# EAGLE design control_pad_v1-1-0x (EAGLE 9.6.2)
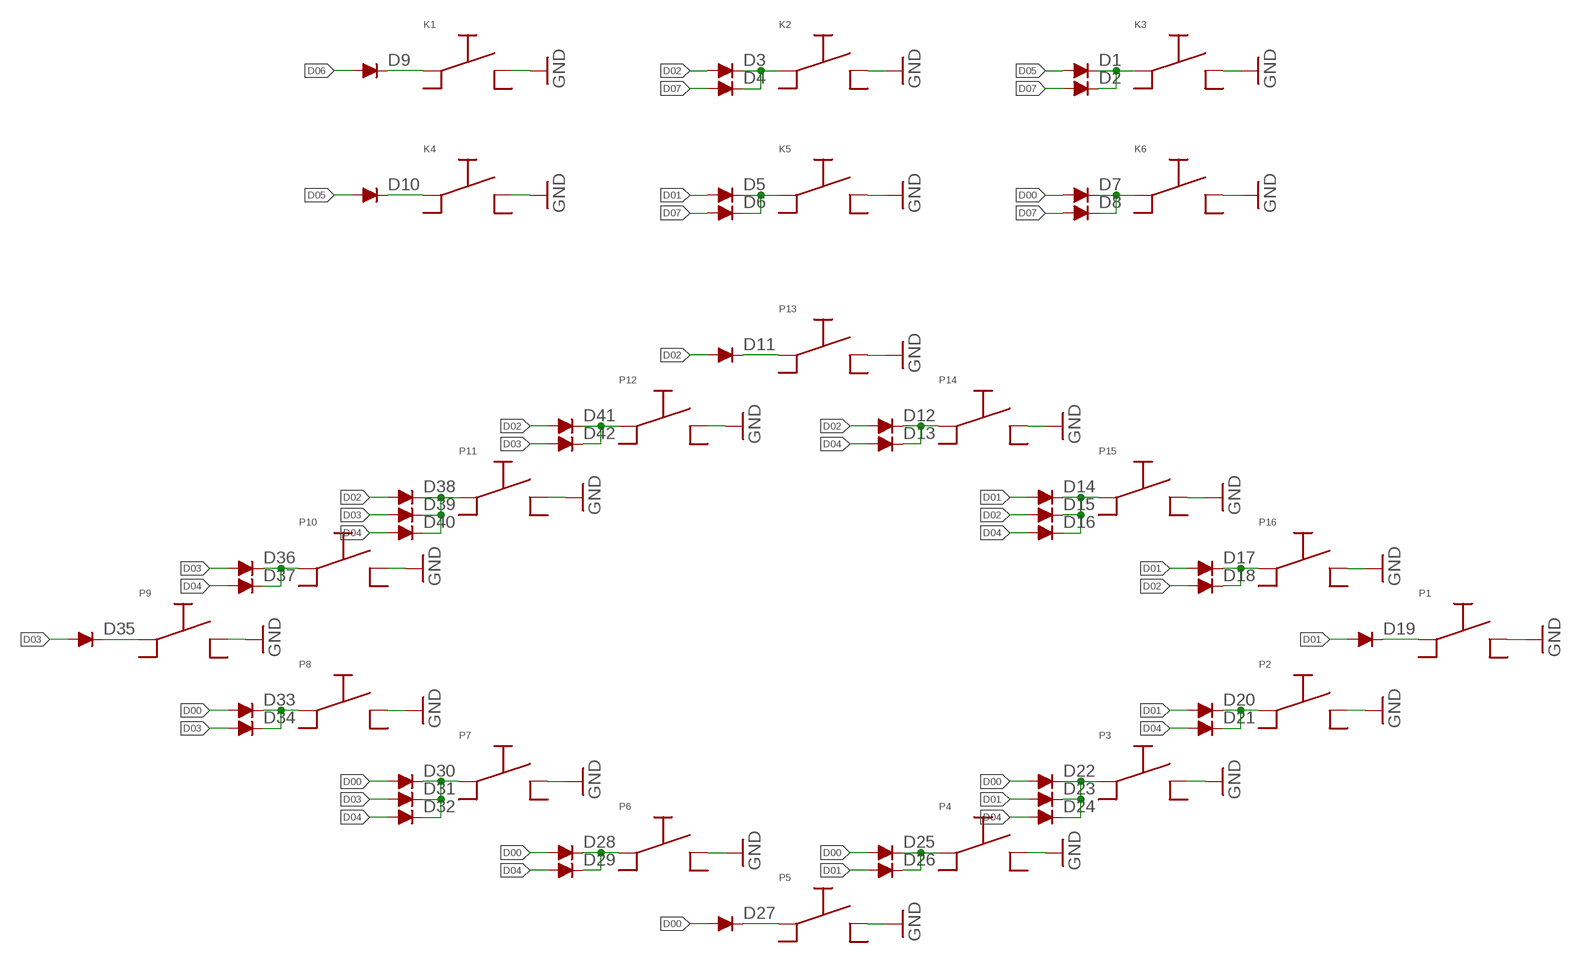
[diagram p0: schematic, sheet 1]

## Parts
D1  1N4148  [DO35-10]
D2  1N4148  [DO35-10]
D3  1N4148  [DO35-10]
D4  1N4148  [DO35-10]
D5  1N4148  [DO35-10]
D6  1N4148  [DO35-10]
D7  1N4148  [DO35-10]
D8  1N4148  [DO35-10]
D9  1N4148  [DO35-10]
D10  1N4148  [DO35-10]
D11  1N4148  [DO35-10]
D12  1N4148  [DO35-10]
D13  1N4148  [DO35-10]
D14  1N4148  [DO35-10]
D15  1N4148  [DO35-10]
D16  1N4148  [DO35-10]
D17  1N4148  [DO35-10]
D18  1N4148  [DO35-10]
D19  1N4148  [DO35-10]
D20  1N4148  [DO35-10]
D21  1N4148  [DO35-10]
D22  1N4148  [DO35-10]
D23  1N4148  [DO35-10]
D24  1N4148  [DO35-10]
D25  1N4148  [DO35-10]
D26  1N4148  [DO35-10]
D27  1N4148  [DO35-10]
D28  1N4148  [DO35-10]
D29  1N4148  [DO35-10]
D30  1N4148  [DO35-10]
D31  1N4148  [DO35-10]
D32  1N4148  [DO35-10]
D33  1N4148  [DO35-10]
D34  1N4148  [DO35-10]
D35  1N4148  [DO35-10]
D36  1N4148  [DO35-10]
D37  1N4148  [DO35-10]
D38  1N4148  [DO35-10]
D39  1N4148  [DO35-10]
D40  1N4148  [DO35-10]
D41  1N4148  [DO35-10]
D42  1N4148  [DO35-10]
K1  TACT-SPST  [TACT-SPST]
K2  TACT-SPST  [TACT-SPST]
K3  TACT-SPST  [TACT-SPST]
K4  TACT-SPST  [TACT-SPST]
K5  TACT-SPST  [TACT-SPST]
K6  TACT-SPST  [TACT-SPST]
P1  TACT-SPST  [TACT-SPST]
P2  TACT-SPST  [TACT-SPST]
P3  TACT-SPST  [TACT-SPST]
P4  TACT-SPST  [TACT-SPST]
P5  TACT-SPST  [TACT-SPST]
P6  TACT-SPST  [TACT-SPST]
P7  TACT-SPST  [TACT-SPST]
P8  TACT-SPST  [TACT-SPST]
P9  TACT-SPST  [TACT-SPST]
P10  TACT-SPST  [TACT-SPST]
P11  TACT-SPST  [TACT-SPST]
P12  TACT-SPST  [TACT-SPST]
P13  TACT-SPST  [TACT-SPST]
P14  TACT-SPST  [TACT-SPST]
P15  TACT-SPST  [TACT-SPST]
P16  TACT-SPST  [TACT-SPST]

## Nets
D00: D7.A D22.A D25.A D27.A D28.A D30.A D33.A
D01: D5.A D14.A D17.A D19.A D20.A D23.A D26.A
D02: D3.A D11.A D12.A D15.A D18.A D38.A D41.A
D03: D31.A D34.A D35.A D36.A D39.A D42.A
D04: D13.A D16.A D21.A D24.A D29.A D32.A D37.A D40.A
D05: D1.A D10.A
D06: D9.A
D07: D2.A D4.A D6.A D8.A
GND: K1.P$2 K1.P$4 K2.P$2 K2.P$4 K3.P$2 K3.P$4 K4.P$2 K4.P$4 K5.P$2 K5.P$4 K6.P$2 K6.P$4 P1.P$2 P1.P$4 P2.P$2 P2.P$4 P3.P$2 P3.P$4 P4.P$2 P4.P$4 P5.P$2 P5.P$4 P6.P$2 P6.P$4 P7.P$2 P7.P$4 P8.P$2 P8.P$4 P9.P$2 P9.P$4 P10.P$2 P10.P$4 P11.P$2 P11.P$4 P12.P$2 P12.P$4 P13.P$2 P13.P$4 P14.P$2 P14.P$4 P15.P$2 P15.P$4 P16.P$2 P16.P$4
N$1: D9.C K1.P$1 K1.P$3
N$2: D10.C K4.P$1 K4.P$3
N$3: D11.C P13.P$1 P13.P$3
N$6: D1.C D2.C K3.P$1 K3.P$3
N$9: D3.C D4.C K2.P$1 K2.P$3
N$11: D5.C D6.C K5.P$1 K5.P$3
N$13: D7.C D8.C K6.P$1 K6.P$3
N$14: D14.C D15.C D16.C P15.P$1 P15.P$3
N$16: D12.C D13.C P14.P$1 P14.P$3
N$17: D19.C P1.P$1 P1.P$3
N$20: D17.C D18.C P16.P$1 P16.P$3
N$22: D20.C D21.C P2.P$1 P2.P$3
N$27: D22.C D23.C D24.C P3.P$1 P3.P$3
N$31: D25.C D26.C P4.P$1 P4.P$3
N$32: D27.C P5.P$1 P5.P$3
N$36: D28.C D29.C P6.P$1 P6.P$3
N$39: D30.C D31.C D32.C P7.P$1 P7.P$3
N$46: D33.C D34.C P8.P$1 P8.P$3
N$49: D35.C P9.P$1 P9.P$3
N$52: D36.C D37.C P10.P$1 P10.P$3
N$55: D38.C D39.C D40.C P11.P$1 P11.P$3
N$62: D41.C D42.C P12.P$1 P12.P$3

## Library data of the parts
D1-D42 = aq-diode:1N4148: DIODE high speed (Philips)
K1-K6 P1-P16 = aq-switch-misc:TACT-SPST: Tactile Switch - 6mm x 6mm generic

## Net classes
0 default: width 0.508 mm, clearance 0.127 mm

## Board
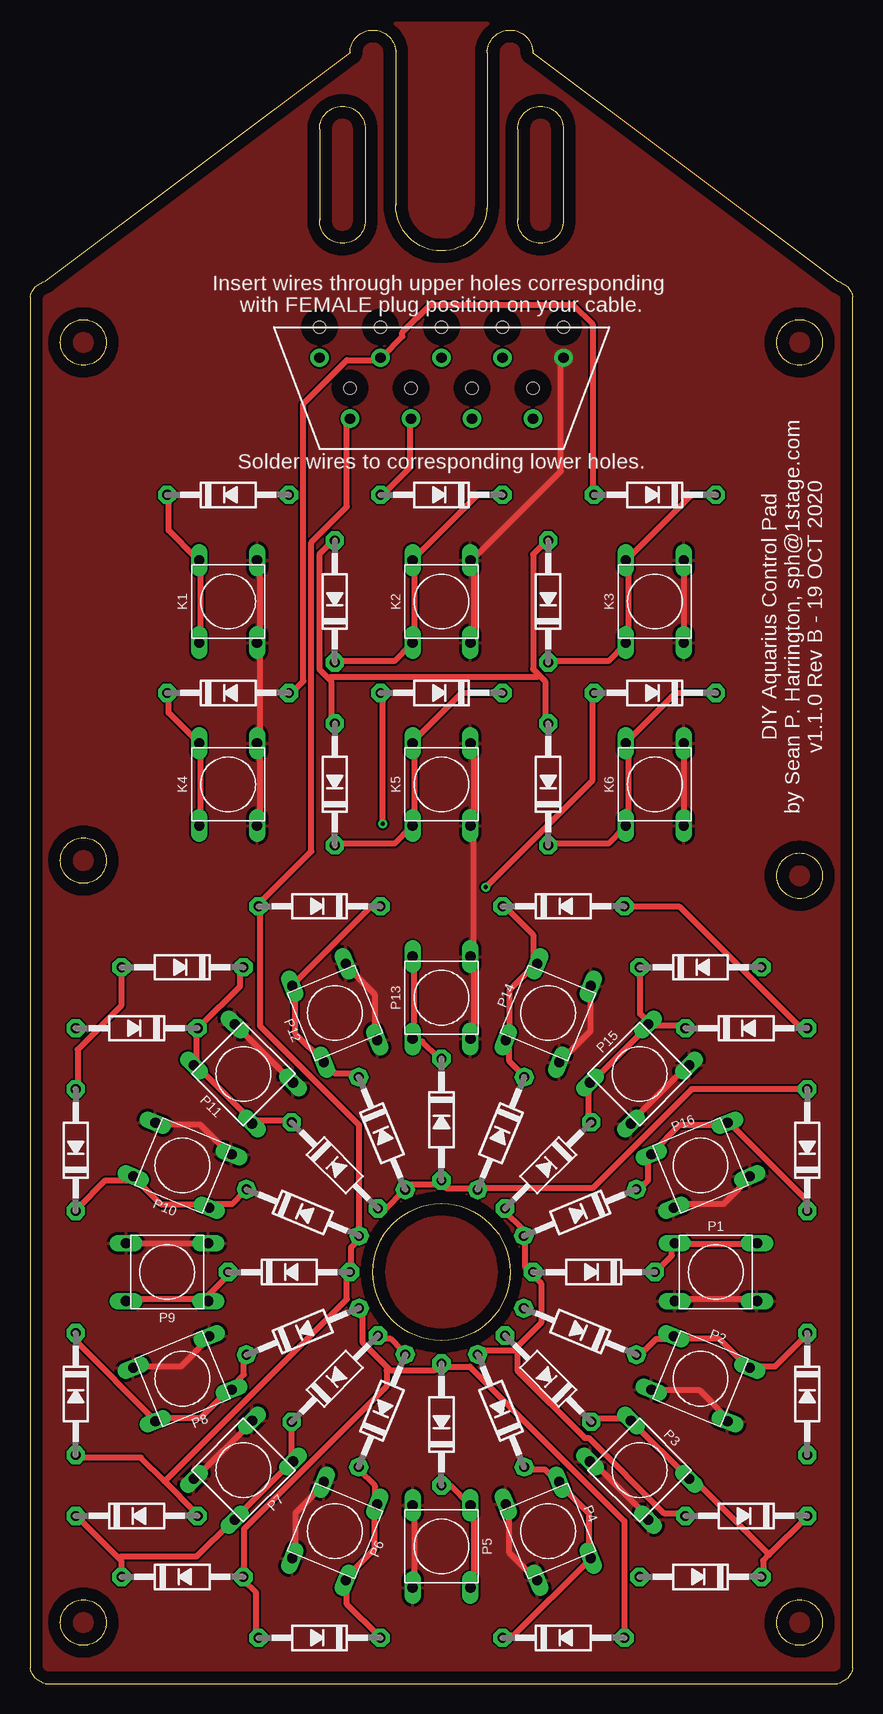
[diagram p1: board, top side]
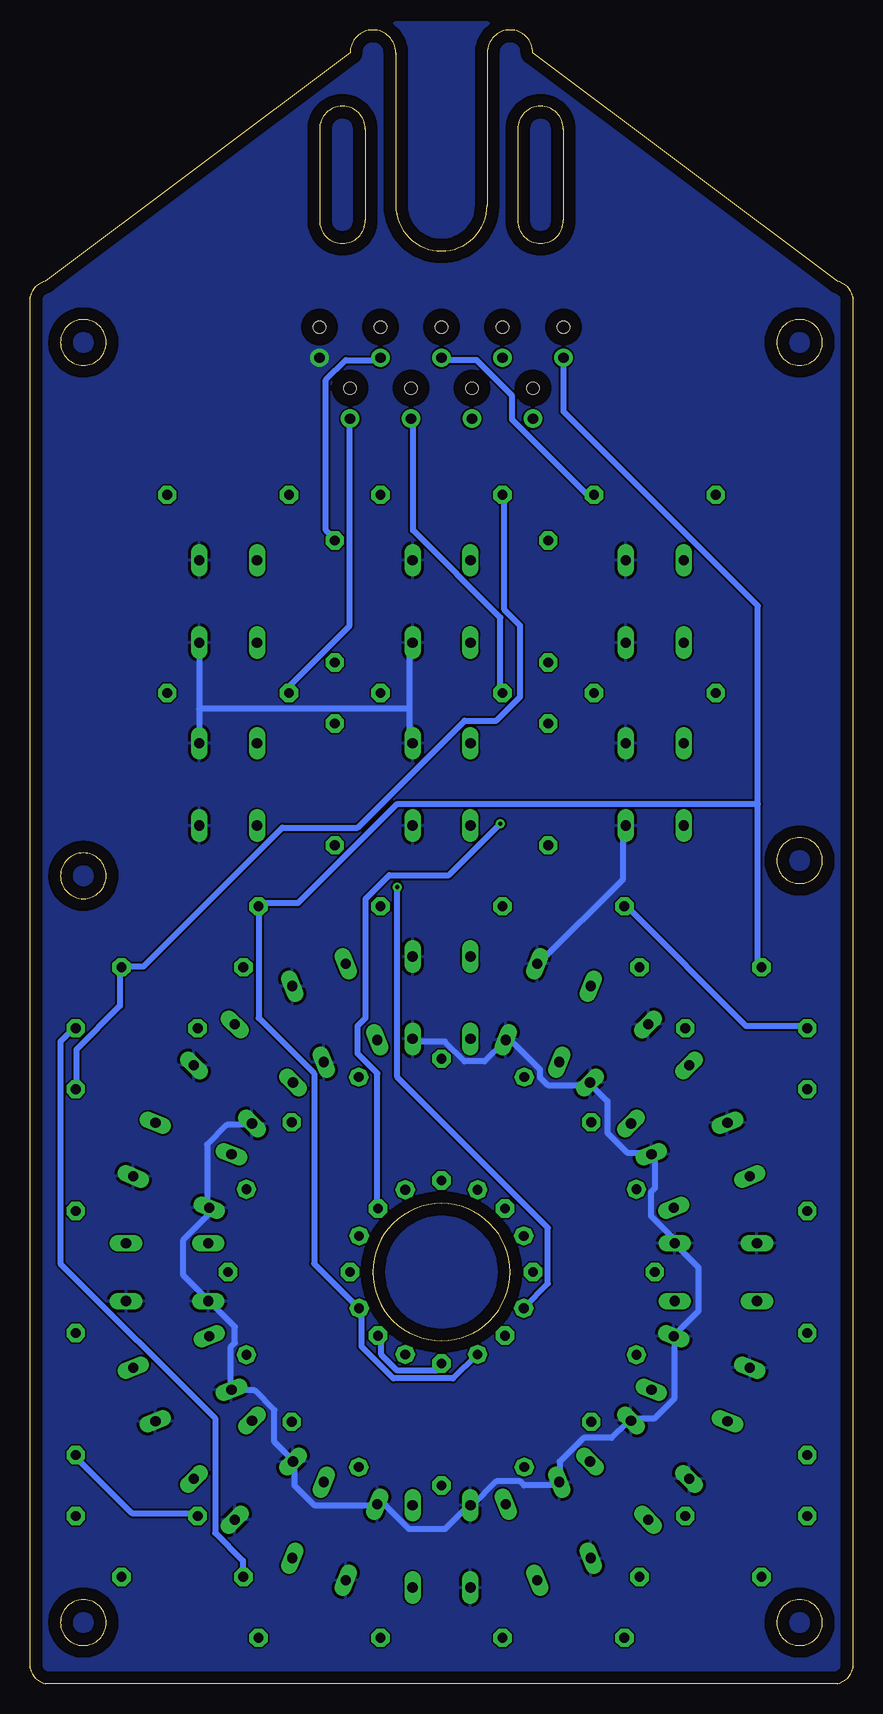
[diagram p2: board, bottom side, seen from below]

Size 68.58 x 137.79 mm. Coordinates in mm from the lower left corner, seen from the top.
Outline: 1.27,0 67.31,0 arc63 68.58,1.27 68.58,115.57 arc63 67.31,116.84 41.91,135.89 arc180 38.1,135.89 38.1,130.81 38.1,123.19 arc-180 30.48,123.19 30.48,130.81 30.48,135.89 arc180 26.67,135.89 1.27,116.84 arc63 0,115.57 0,1.27 arc63 1.27,0
Outline: 28.57,34.29 arc-180 40.01,34.29 arc-180 28.57,34.29
Outline: 44.45,129.54 44.45,121.92 arc-180 40.64,121.92 40.64,129.54 arc-180 44.45,129.54
Outline: 24.13,129.54 24.13,121.92 arc180 27.94,121.92 27.94,129.54 arc180 24.13,129.54
Outline: 62.23,111.76 arc-180 66.04,111.76 arc-180 62.23,111.76
Outline: 2.54,111.76 arc-180 6.35,111.76 arc-180 2.54,111.76
Outline: 6.35,5.08 arc-180 2.54,5.08 arc-180 6.35,5.08
Outline: 66.04,5.08 arc-180 62.23,5.08 arc-180 66.04,5.08
Outline: 66.04,67.31 arc-180 62.23,67.31 arc-180 66.04,67.31
Outline: 2.54,68.58 arc-180 6.35,68.58 arc-180 2.54,68.58
Copper layers (1*16): Top 0.035mm / dielectric 1.5mm / Bottom 0.035mm
Design rules "default": minimum track width 6mil, minimum drill 0.35mm, track to track 6mil, track to pad 6mil, pad to pad 6mil, via to via 6mil, smd to smd 6mil, copper to edge 40mil, drill to drill 6mil, minimum pad ring 10mil, minimum via ring 8mil, stop-mask expansion 4mil, vias tented up to drill 0mil, thermal gap 10mil
Holes 1 mm at 26.67,107.95 31.75,107.95 44.45,113.03 36.83,107.95 41.91,107.95 24.13,113.03 29.21,113.03 39.37,113.03 34.29,113.03

### Footprints (pad centres in the part's own frame; a part is rotated, then mirrored left to right if it is on the bottom)
DO35-10 = drill 0.813 pad 1.524 octagon: A 5.08,0; C -5.08,0
TACT-SPST = drill 0.85 long: P$1 -3.429,2.413; P$2 -3.429,-2.413; P$3 3.429,2.413; P$4 3.429,-2.413

### Placement (x,y rotation side)
D1  52.07,99.06 180 top
D2  43.18,90.17 90 top
D3  34.29,99.06 180 top
D4  25.4,90.17 90 top
D5  34.29,82.55 180 top
D6  25.4,74.93 90 top
D7  52.07,82.55 180 top
D8  43.18,74.93 90 top
D9  16.51,99.06 0 top
D10  16.51,82.55 0 top
D11  34.29,46.99 270 top
D12  39.24,45.85 247.5 top
D13  44.45,64.77 0 top
D14  43.18,43.18 225 top
D15  55.88,59.69 0 top
D16  59.69,54.61 0 top
D17  45.85,39.24 202.5 top
D18  64.77,44.45 90 top
D19  46.99,34.29 180 top
D20  64.77,24.13 270 top
D21  45.85,29.34 157.5 top
D22  43.18,25.4 135 top
D23  59.69,13.97 180 top
D24  55.88,8.89 180 top
D25  44.45,3.81 0 top
D26  39.24,22.73 112.5 top
D27  34.29,21.59 90 top
D28  24.13,3.81 180 top
D29  29.34,22.73 67.5 top
D30  12.7,8.89 0 top
D31  8.89,13.97 0 top
D32  25.4,25.4 45 top
D33  22.73,29.34 22.5 top
D34  3.81,24.13 270 top
D35  21.59,34.29 0 top
D36  22.73,39.24 337.5 top
D37  3.81,44.45 90 top
D38  25.4,43.18 315 top
D39  8.89,54.61 180 top
D40  12.7,59.69 180 top
D41  29.34,45.85 292.5 top
D42  24.13,64.77 180 top
K1  16.51,90.17 90 top
K2  34.29,90.17 90 top
K3  52.07,90.17 90 top
K4  16.51,74.93 90 top
K5  34.29,74.93 90 top
K6  52.07,74.93 90 top
P1  57.15,34.29 0 top
P2  55.88,25.4 337.5 top
P3  50.8,17.78 315 top
P4  43.18,12.7 292.5 top
P5  34.29,11.43 270 top
P6  25.4,12.7 247.5 top
P7  17.78,17.78 225 top
P8  12.7,25.4 202.5 top
P9  11.43,34.29 180 top
P10  12.7,43.18 157.5 top
P11  17.78,50.8 135 top
P12  25.4,55.88 112.5 top
P13  34.29,57.15 90 top
P14  43.18,55.88 67.5 top
P15  50.8,50.8 45 top
P16  55.88,43.18 22.5 top

### Tracks (layer width: path | path; a pad name or v marks a point on that pad's centre or on a via)
D00  (via drill 0.35, 0.85 pad 1.52)
  Top 0.508: D28.A 18.82,3.96 18.82,7.59 17.83,8.59 D30.A 17.83,8.91 17.83,12.88 29.72,24.77 29.72,26.09 29.88,26.25 | D25.A 49.53,3.96 49.53,13.54 36.65,26.42 34.34,26.42 D27.A 34.01,26.42 33.68,26.09 30.05,26.09 29.88,26.25 | 29.88,26.25 27.74,28.4 27.74,31.04 D33.A | v37.97,66.37 46.89,75.29 46.89,82.55 D7.A
  Bottom 0.508: v41.91,105.41 41.94,105.33 41.94,88.16 46.89,83.21 46.89,82.55 D7.A | D22.A 39.29,28.73 39.29,27.41 37.97,26.09 34.67,26.09 34.34,26.42 D27.A | v37.97,66.37 37.97,50.52 25.43,37.97 25.43,33.35 27.41,31.37 D33.A
D01  (via drill 0.35, 0.85 pad 1.52)
  Top 0.508: D14.A 39.62,39.29 40.95,37.97 40.95,37.31 D17.A 41.27,36.98 41.27,34.67 41.6,34.34 D19.A 41.94,34.01 42.6,33.35 42.6,30.05 40.45,27.9 | 40.45,27.9 40.28,27.74 37.31,27.74 D26.A | D23.A 54.48,14.2 52.83,14.2 46.56,20.47 46.23,20.47 40.62,26.09 40.62,27.74 40.45,27.9 | v29.39,71.65 29.39,82.55 D5.A
  Bottom 0.508: v36.83,105.41 36.65,105.33 36.65,96.09 29.39,88.82 29.39,82.55 D5.A | D23.A 54.81,14.2 60.1,14.2 64.72,18.82 D20.A | v29.39,71.65 33.68,67.36 38.63,67.36 40.62,65.38 40.62,55.47 41.27,54.81 41.27,52.5 39.62,50.85 39.62,39.62 D14.A
D02  (via drill 0.85 pad 1.52)
  Top 0.508: D38.A 29.06,39.62 29.72,39.62 31.04,40.95 D41.A 31.37,41.27 31.7,41.6 34.01,41.6 D11.A 34.34,41.6 34.67,41.27 36.98,41.27 D12.A 37.31,41.27 46.89,41.27 55.14,49.53 64.72,49.53 D18.A | v31.75,105.41 31.7,105.33 31.7,101.37 29.39,99.06 D3.A
  Bottom 0.508: D18.A 64.72,49.53 64.72,52.83 61.09,56.46 61.09,59.44 D15.A 60.76,59.77 59.11,59.77 47.55,71.32 41.27,71.32 32.36,80.24 29.72,80.24 27.74,82.22 27.74,88.16 29.06,89.48 29.06,99.06 D3.A
D03  (via drill 0.85 pad 1.52)
  Top 0.508: 11.23,16.84 13.87,14.2 D31.A | 11.23,16.84 9.25,18.82 3.96,18.82 D34.A | 11.23,16.84 26.42,32.03 26.42,34.01 D35.A 26.75,34.34 26.75,36.32 27.41,36.98 D36.A 27.41,37.31 27.41,46.56 19.15,54.81 19.15,64.72 D42.A 19.15,65.05 23.44,69.34 23.44,95.1 26.42,98.07 26.42,105.33 v26.67,105.41
  Bottom 0.508: D39.A 3.96,54.81 8.91,54.81 18.82,64.72 D42.A
D04  (via drill 0.85 pad 1.52)
  Top 0.508: D37.A 3.96,49.53 3.96,52.83 7.59,56.46 7.59,59.44 D40.A | D32.A 29.06,28.73 30.05,28.73 31.04,27.74 D29.A | D13.A 49.53,64.72 54.15,64.72 64.06,54.81 64.72,54.81 D16.A
  Bottom 0.508: 7.92,73.3 7.92,59.77 D40.A | 7.92,73.3 7.92,89.81 24.11,105.99 24.11,110.29 v24.13,110.49 | D29.A 31.37,27.41 33.35,25.43 38.3,25.43 40.95,28.07 40.95,31.04 D21.A 41.27,31.37 44.91,35 44.91,50.85 49.53,55.47 49.53,64.72 D13.A 49.53,65.05 46.23,65.05 37.97,73.3 7.92,73.3 | D24.A 50.85,8.91 50.85,10.24 53.16,12.55 53.16,22.12 66.04,35 66.04,53.49 65.05,54.48 D16.A
D05  (via drill 0.85 pad 1.52)
  Top 0.508: D10.A 21.79,82.55 22.78,83.54 22.78,106.66 26.42,110.29 29.06,110.29 v29.21,110.49 29.39,110.62 31.04,112.27 31.04,112.6 33.35,114.91 45.24,114.91 46.89,113.26 46.89,99.06 D1.A
D06  (via drill 0.85 pad 1.52)
  Bottom 0.508: v34.29,110.49 34.01,110.29 31.37,110.29 28.4,107.31 28.4,105.33 22.12,99.06 21.79,99.06 D9.A
D07  (via drill 0.85 pad 1.52)
  Top 0.508: 24.93,83.71 24.11,84.53 24.11,94.11 25.09,95.1 D4.A | 24.93,83.71 25.09,83.54 25.09,80.24 D6.A | 42.43,84.04 41.94,84.53 41.94,94.11 42.93,95.1 D2.A | 42.43,84.04 42.93,83.54 42.93,80.24 D8.A | 24.93,83.71 25.09,83.87 42.27,83.87 42.43,84.04
  Bottom 0.508: v39.37,110.49 39.62,110.29 42.27,110.29 43.92,108.64 43.92,96.09 43.26,95.43 D2.A
GND  (via drill 0.85 pad 1.52)
  Top 0.508: P16.P$2 53.82,39.95 57.78,39.95 59.77,41.94 P16.P$4 | P15.P$2 50.19,46.89 54.81,51.51 P15.P$4 | P1.P$2 53.82,32.03 60.43,32.03 P1.P$4 | P2.P$2 51.84,24.43 55.8,24.43 58.12,22.12 P2.P$4 | P4.P$2 39.95,14.86 39.95,10.9 41.94,8.91 P4.P$4 | P3.P$2 46.89,18.49 51.51,13.87 P3.P$4 | K6.P$2 54.48,71.65 54.48,78.26 K6.P$4 | K3.P$2 54.48,86.84 54.48,93.45 K3.P$4 | K5.P$4 36.98,78.26 36.98,71.65 K5.P$2 36.98,71.32 36.98,60.76 P13.P$4 36.98,60.43 36.98,53.82 P13.P$2 | v44.45,110.49 44.25,110.29 44.25,101.04 36.98,93.78 K2.P$4 36.98,93.45 36.98,86.84 K2.P$2 | P5.P$4 32.03,8.26 32.03,14.86 P5.P$2 | P6.P$4 22.12,10.57 22.12,14.2 24.43,16.51 P6.P$2 | P8.P$4 8.91,26.42 12.55,26.42 14.86,28.73 P8.P$2 | P7.P$4 13.87,17.17 18.49,21.79 P7.P$2 | K4.P$2 19.15,71.65 19.15,78.26 K4.P$4 19.15,78.59 19.15,86.51 K1.P$2 19.15,86.84 19.15,93.45 K1.P$4 | P9.P$4 8.26,36.65 14.86,36.65 P9.P$2 | P10.P$4 10.57,46.56 14.2,46.56 16.51,44.25 P10.P$2 | P11.P$2 21.79,50.19 17.17,54.81 P11.P$4 | P12.P$2 28.73,53.82 28.73,57.45 26.42,59.77 P12.P$4 | P14.P$2 46.72,54.41 P14.P$4
  Bottom 0.508: P15.P$2 50.19,46.56 52.17,46.56 53.82,44.91 53.82,39.95 P16.P$2 53.82,39.62 53.82,38.96 55.8,36.98 55.8,34.01 53.82,32.03 P1.P$2 53.49,31.7 51.51,29.72 51.51,28.4 51.84,28.07 51.84,24.77 P2.P$2 51.51,24.43 49.86,24.43 48.21,22.78 48.21,20.14 46.89,18.82 P3.P$2 46.56,18.49 46.56,16.51 44.91,14.86 39.95,14.86 P4.P$2 39.62,14.86 38.96,14.86 36.98,12.88 34.01,12.88 32.03,14.86 P5.P$2 31.7,14.86 29.72,16.84 27.74,16.84 27.41,16.51 24.77,16.51 P6.P$2 24.43,16.84 24.43,18.49 22.45,20.47 20.14,20.47 18.82,21.79 P7.P$2 18.49,22.12 16.51,22.12 14.86,23.77 14.86,28.73 P8.P$2 14.86,29.06 12.88,31.04 12.88,34.67 14.86,36.65 P9.P$2 14.86,36.98 16.84,38.96 16.84,40.95 16.51,41.27 16.51,43.92 P10.P$2 16.84,44.25 18.82,44.25 20.47,45.9 20.47,48.54 21.79,49.86 P11.P$2 22.12,49.86 25.43,49.86 26.09,50.52 26.09,51.18 28.73,53.82 P12.P$2 29.06,53.49 30.71,51.84 32.36,51.84 34.01,53.49 36.65,53.49 P13.P$2 | 54.48,81.23 54.48,86.51 K3.P$2 | 54.48,81.23 54.48,78.59 K6.P$4 | 36.98,81.23 36.98,86.51 K2.P$2 | 36.98,81.23 36.98,78.59 K5.P$4 | 36.98,81.23 54.48,81.23 | K4.P$2 19.15,71.32 19.15,67.03 26.09,60.1 P12.P$4
  pour Top: 0,115.57 30.48,138.43 38.1,138.43 68.58,115.57 68.58,0 0,0
  pour Bottom: 0,115.57 30.48,138.43 38.1,138.43 68.58,115.57 68.58,0 0,0
N$1
  Top 0.508: K1.P$1 14.2,86.84 14.2,93.45 K1.P$3 13.87,93.78 11.56,96.09 11.56,99.06 D9.C
N$2
  Top 0.508: K4.P$1 14.2,71.65 14.2,78.26 K4.P$3 13.87,78.59 11.56,80.9 11.56,82.55 D10.C
N$3
  Top 0.508: D11.C 34.01,52.17 32.69,53.49 32.03,53.49 P13.P$1 32.03,53.82 32.03,60.43 P13.P$3
N$6
  Top 0.508: D2.C 43.26,85.19 48.21,85.19 49.53,86.51 K3.P$1 49.86,86.84 49.86,93.45 K3.P$3 49.86,93.78 55.14,99.06 57.12,99.06 D1.C
N$9
  Top 0.508: D4.C 25.43,85.19 30.38,85.19 31.7,86.51 K2.P$1 32.03,86.84 32.03,93.45 K2.P$3 32.03,93.78 37.31,99.06 39.29,99.06 D3.C
N$11
  Top 0.508: D6.C 25.43,70 30.38,70 31.7,71.32 K5.P$1 32.03,71.65 32.03,78.26 K5.P$3 32.03,78.59 35.99,82.55 39.29,82.55 D5.C
N$13
  Top 0.508: D8.C 43.26,70 48.21,70 49.53,71.32 K6.P$1 49.86,71.65 49.86,78.26 K6.P$3 49.86,78.59 53.82,82.55 57.12,82.55 D7.C
N$14
  Top 0.508: D14.C 46.56,46.89 46.56,49.86 P15.P$1 46.89,50.19 51.51,54.81 P15.P$3 | P15.P$3 51.84,54.81 54.48,54.81 D16.C | D15.C 50.85,59.44 50.85,55.8 51.51,55.14 P15.P$3
N$16
  Top 0.508: D12.C 40.95,50.85 39.95,51.84 39.95,53.49 P14.P$1 39.95,53.82 39.95,57.78 41.94,59.77 P14.P$3 41.94,60.1 41.94,62.41 39.62,64.72 D13.C
N$17
  Top 0.508: D19.C 52.17,34.34 53.49,35.66 53.49,36.65 P1.P$1 53.82,36.65 60.43,36.65 P1.P$3
N$20
  Top 0.508: D17.C 50.85,41.27 51.51,41.94 51.51,43.92 P16.P$1 51.84,44.25 54.15,46.56 58.12,46.56 P16.P$3 58.45,46.56 64.72,40.28 64.72,39.62 D18.C
N$22
  Top 0.508: D21.C 50.85,27.41 52.17,28.73 53.49,28.73 P2.P$1 53.82,28.73 57.45,28.73 59.77,26.42 P2.P$3 60.1,26.42 62.08,26.42 64.72,29.06 D20.C
N$27
  Top 0.508: 61.58,10.73 64.72,13.87 D23.C | 61.58,10.73 61.09,10.24 61.09,8.91 D24.C | D22.C 46.89,22.12 49.86,22.12 P3.P$1 50.19,21.79 54.81,17.17 P3.P$3 55.14,17.17 61.42,10.9 61.58,10.73
N$31
  Top 0.508: D25.C 39.62,3.96 40.28,3.96 46.56,10.24 P4.P$3 46.56,10.57 46.56,14.2 44.25,16.51 P4.P$1 43.92,16.84 42.93,17.83 41.27,17.83 D26.C
N$32
  Top 0.508: P5.P$3 36.98,8.26 36.98,14.86 P5.P$1 36.65,14.86 35,16.51 34.34,16.51 D27.C
N$36
  Top 0.508: D29.C 27.41,17.83 28.73,16.51 28.73,15.19 P6.P$1 28.73,14.86 28.73,11.23 26.42,8.91 P6.P$3 26.42,8.59 26.42,6.6 29.06,3.96 D28.C
N$39
  Top 0.508: 7.43,10.4 3.96,13.87 D31.C | 7.43,10.4 7.59,10.24 7.59,8.91 D30.C | D32.C 21.79,21.79 21.79,18.82 P7.P$1 21.79,18.49 17.17,13.87 P7.P$3 16.84,13.54 13.87,10.57 7.59,10.57 7.43,10.4
N$46
  Top 0.508: D34.C 3.96,29.06 3.96,28.4 10.24,22.12 P8.P$3 10.57,22.12 14.2,22.12 16.51,24.43 P8.P$1 16.84,24.77 17.83,25.76 17.83,27.08 D33.C
N$49
  Top 0.508: 14.53,32.03 14.86,32.03 P9.P$1 14.53,32.03 | 14.53,32.03 8.26,32.03 P9.P$3 | 14.53,32.03 16.51,34.01 D35.C
N$52
  Top 0.508: D36.C 17.83,40.95 16.84,39.95 15.19,39.95 P10.P$1 14.86,39.95 10.9,39.95 8.91,41.94 P10.P$3 8.59,41.94 6.27,41.94 3.96,39.62 D37.C
N$55
  Top 0.508: D38.C 21.79,46.89 18.82,46.89 P11.P$1 18.49,46.89 13.87,51.51 P11.P$3 13.87,51.84 13.87,54.48 D39.C 14.2,54.81 17.5,58.12 17.5,59.44 D40.C
N$62
  Top 0.508: D41.C 27.08,50.85 25.43,50.85 24.77,51.51 P12.P$1 24.43,51.84 22.12,54.15 22.12,58.12 P12.P$3 22.12,58.45 28.4,64.72 29.06,64.72 D42.C

### Text on the board
tPlace: Insert wires through upper holes corresponding / with FEMALE plug position on your cable. | Solder wires to corresponding lower holes. | DIY Aquarius Control Pad / by Sean P. Harrington, sph@1stage.com / v1.1.0 Rev B - 19 OCT 2020